# EAGLE schematic WiFi_Board (EAGLE 6.6.0)
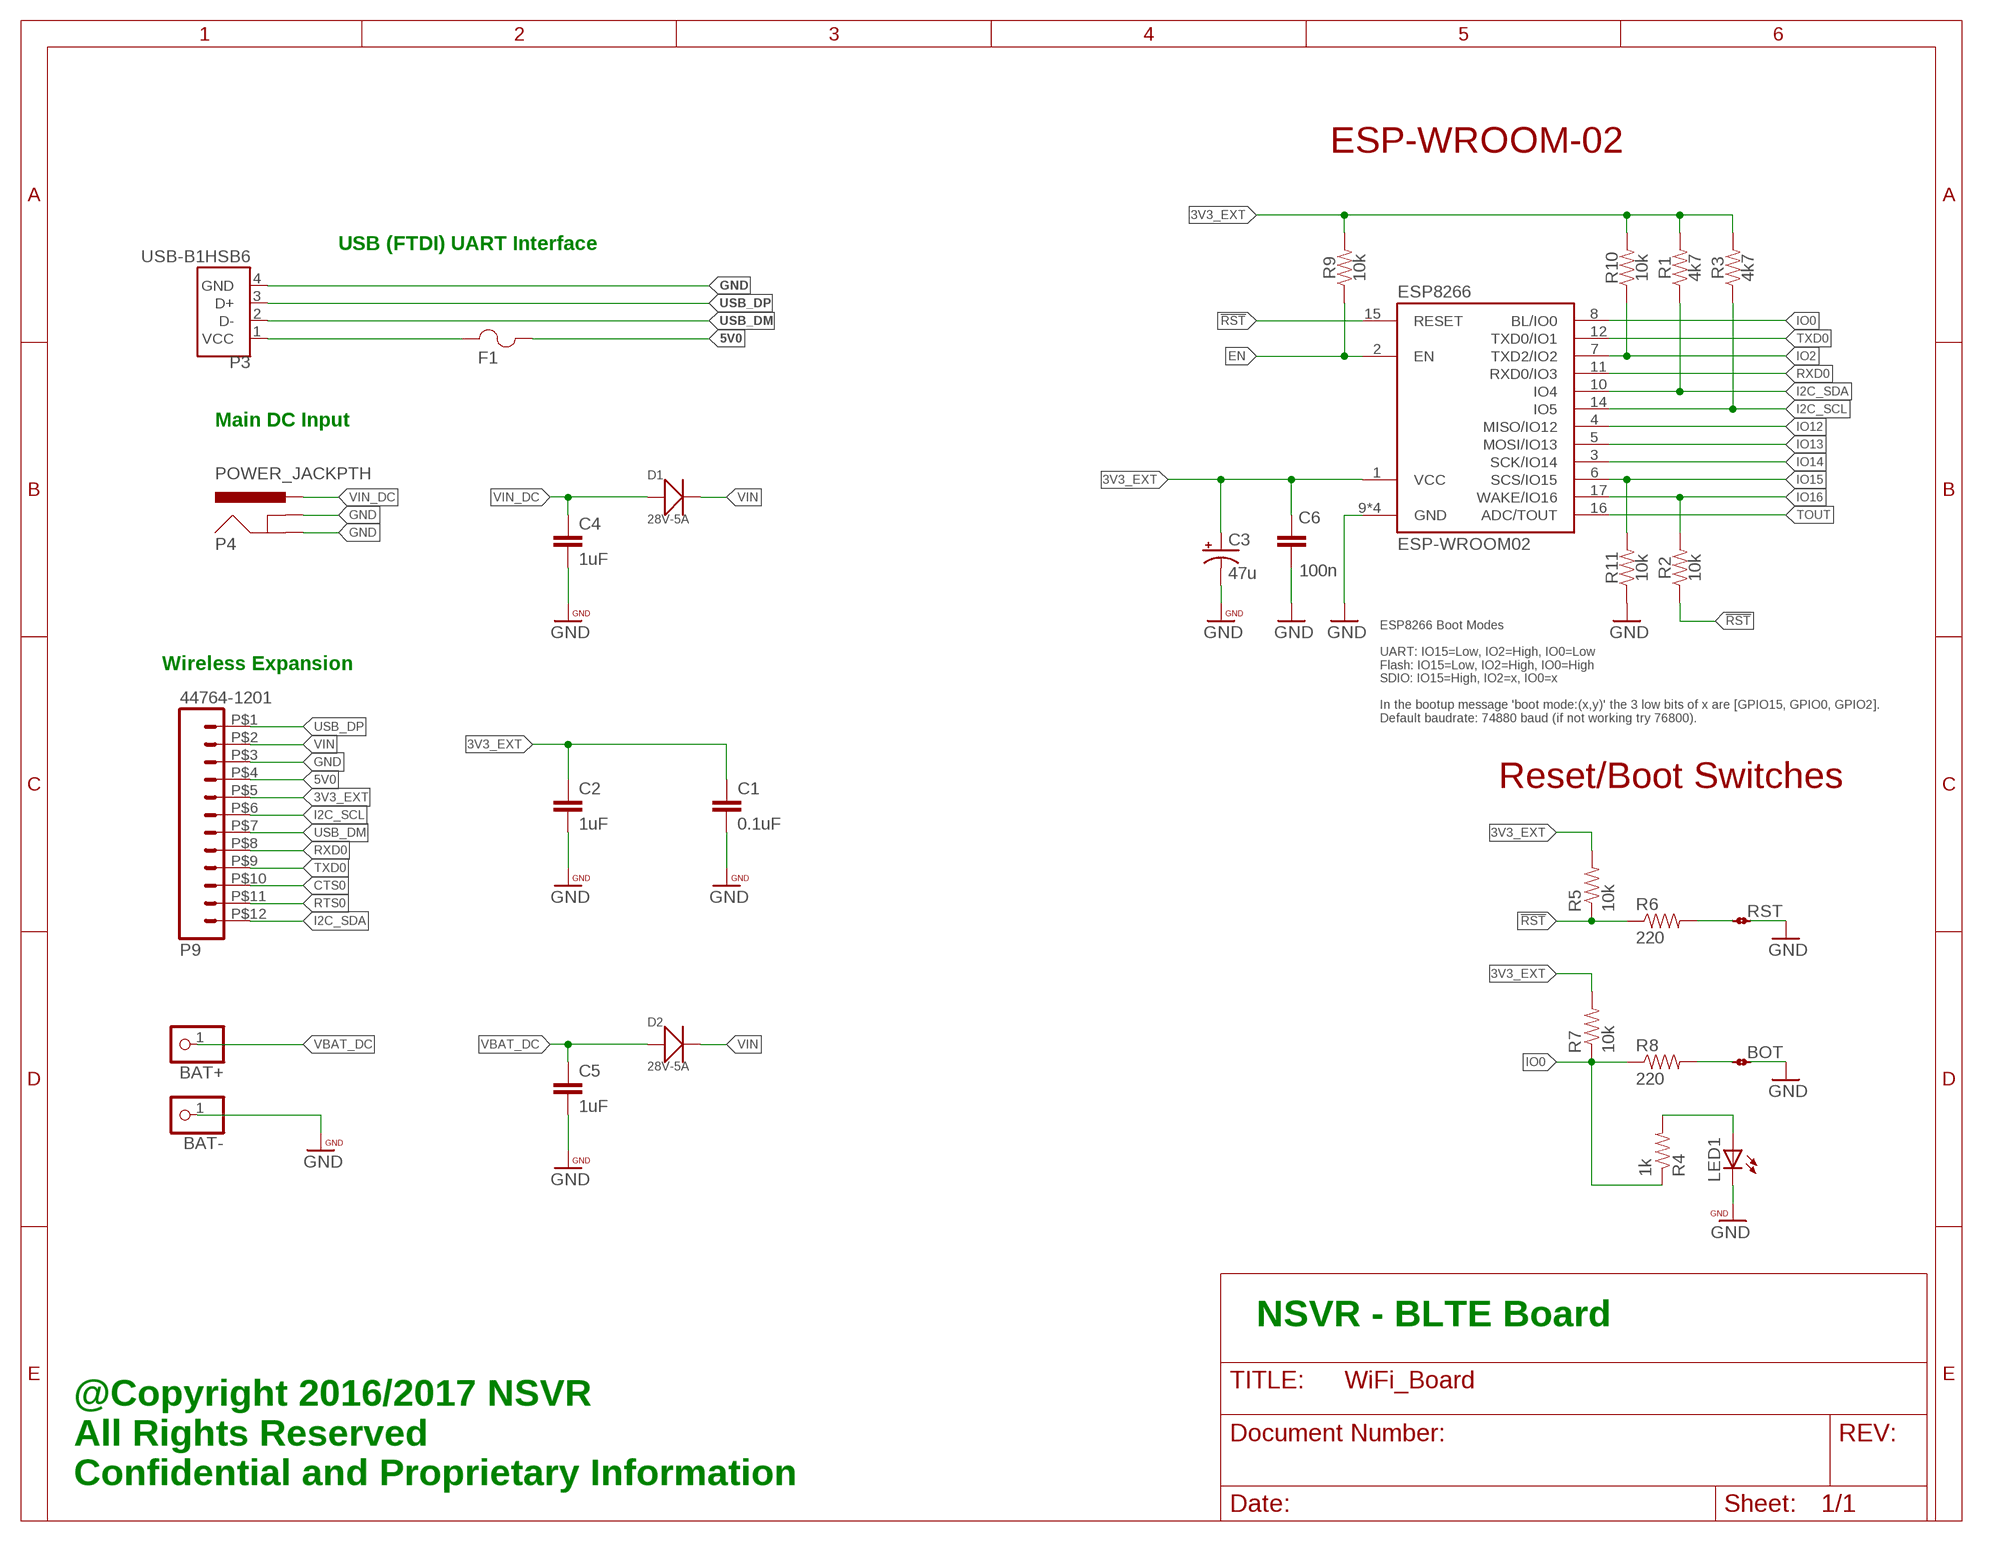
[diagram p0: schematic, sheet 1]

## Parts
BAT+  WPAD-1-PTH  [WPAD-1-PTH-2.54]
BAT-  WPAD-1-PTH  [WPAD-1-PTH-2.54]
BOT  JMP-2-NO-PTH  [JMP-2-NO-PTH-2.54]
C1  0.1uF  CAP0402-CAP  [0402-CAP]
C2  1uF  CAP0402-CAP  [0402-CAP]
C3  47u  CAP_POLD  [PANASONIC_D]
C4  1uF  CAP0402-CAP  [0402-CAP]
C5  1uF  CAP0402-CAP  [0402-CAP]
C6  100n  CAP0402-CAP  [0402-CAP]
D1  28V-5A  SMD-DIODE-SCHOTTKY-28V-5A(DO-214AA)  [DO-214AA]
D2  28V-5A  SMD-DIODE-SCHOTTKY-28V-5A(DO-214AA)  [DO-214AA]
ESP8266  ESP-WROOM02  [ESP-WROOM02]
F1  1206L050YR  [1206LSERIES]
LED1  LEDCHIP-LED0603  [CHIP-LED0603]
P3  USB-B1HSB6  [OST_USB-B1HSB6]
P4  POWER_JACKPTH  [POWER_JACK_PTH]
P9  44764-1201  [44764-1201]
R1  4k7  RESISTOR0402-TYP  [EIA-0402]
R2  10k  RESISTOR0402-TYP  [EIA-0402]
R3  4k7  RESISTOR0402-TYP  [EIA-0402]
R4  1k  RESISTOR0402-TYP  [EIA-0402]
R5  10k  RESISTOR0402-TYP  [EIA-0402]
R6  220  RESISTOR0402-TYP  [EIA-0402]
R7  10k  RESISTOR0402-TYP  [EIA-0402]
R8  220  RESISTOR0402-TYP  [EIA-0402]
R9  10k  RESISTOR0402-TYP  [EIA-0402]
R10  10k  RESISTOR0402-TYP  [EIA-0402]
R11  10k  RESISTOR0402-TYP  [EIA-0402]
RST  JMP-2-NO-PTH  [JMP-2-NO-PTH-2.54]

## Nets
3V3_EXT: C1.1 C2.1 C3.+ C6.2 ESP8266.1(VCC) P9.P$5 R1.2 R3.2 R5.2 R7.2 R9.2 R10.2
5V0: F1.2 P9.P$4
!RST: ESP8266.15(RESET) R2.1 R5.1 R6.1
CTS0: P9.P$10
EN: ESP8266.2(EN) R9.1
GND: BAT-.1 BOT.2 C1.2 C2.2 C3.- C4.2 C5.2 C6.1 ESP8266.9(GND) ESP8266.13(GND) ESP8266.18(GND) ESP8266.TP(GND) LED1.C P3.4(GND) P4.GND P4.GNDBREAK P9.P$3 R11.1 RST.2
I2C_SCL: ESP8266.14(IO5) P9.P$6 R3.1
I2C_SDA: ESP8266.10(IO4) P9.P$12 R1.1
IO0: ESP8266.8(BL/IO0) R4.1 R7.1 R8.1
IO2: ESP8266.7(TXD2/IO2) R10.1
IO12: ESP8266.4(MISO/IO12)
IO13: ESP8266.5(MOSI/IO13)
IO14: ESP8266.3(SCK/IO14)
IO15: ESP8266.6(SCS/IO15) R11.2
IO16: ESP8266.17(WAKE/IO16) R2.2
LED1: LED1.A R4.2
N$1: R6.2 RST.1
N$2: BOT.1 R8.2
RTS0: P9.P$11
RXD0: ESP8266.11(RXD0/IO3) P9.P$8
TOUT: ESP8266.16(ADC/TOUT)
TXD0: ESP8266.12(TXD0/IO1) P9.P$9
USB_DM: P3.2(D-) P9.P$7
USB_DP: P3.3(D+) P9.P$1
VBAT_DC: BAT+.1 C5.1 D2.+
VBUS_IN: F1.1 P3.1(VCC)
VIN: D1.- D2.- P9.P$2
VIN_DC: C4.1 D1.+ P4.PWR

## Notes on the sheet
- ESP-WROOM-02
- USB (FTDI) UART Interface
- Main DC Input
- ESP8266 Boot Modes
  
  UART: IO15=Low, IO2=High, IO0=Low
  Flash: IO15=Low, IO2=High, IO0=High
  SDIO: IO15=High, IO2=x, IO0=x
  
  In the bootup message 'boot mode:(x,y)' the 3 low bits of x are [GPIO15, GPIO0, GPIO2].
  Default baudrate: 74880 baud (if not working try 76800).
- Wireless Expansion
- Reset/Boot Switches
- NSVR - BLTE Board
- @Copyright 2016/2017 NSVR
  All Rights Reserved
  Confidential and Proprietary Information

## Library data of the parts
BAT+ BAT- = PatternAgents-ProtoPads:WPAD-1: Wire Pad - Single Good for scope lead clips, test jumpers, probe points, etc. PatternAgents ProtoPads Library Schematic and PCB layout libraries for design patterns by PatternAgents. For the CADSoft Eagle CAD program : http://www.cadsoftusa.com/download-eagle/ Source LBR : http://www.patternagents.com Github : https://github.com/PatternAgents License : http://creativecommons.org/licenses/by-sa/4.0/ (Creative Commons 4.0) THIS SOFTWARE IS PROVIDED BY THE CONTRIBUTORS "AS IS" AND WITHOUT ANY EXPRESS OR IMPLIED WARRANTIES, INCLUDING, BUT NOT LIMITED TO, THE IMPLIED WARRANTIES OF MERCHANTABILITY AND FITNESS FOR A PARTICULAR PURPOSE ARE DISCLAIMED. IN NO EVENT SHALL THE COPYRIGHT OWNER OR CONTRIBUTORS BE LIABLE FOR ANY DIRECT, INDIRECT, INCIDENTAL, SPECIAL, EXEMPLARY, OR CONSEQUENTIAL DAMAGES (INCLUDING, BUT NOT LIMITED TO, PROCUREMENT OF SUBSTITUTE GOODS OR SERVICES; LOSS OF USE, DATA, OR PROFITS; OR BUSINESS INTERRUPTION) HOWEVER CAUSED AND ON ANY THEORY OF LIABILITY, WHETHER IN CONTRACT, STRICT LIABILITY, OR TORT (INCLUDING NEGLIGENCE OR OTHERWISE) ARISING IN ANY WAY OUT OF THE USE OF THIS SOFTWARE, EVEN IF ADVISED OF THE POSSIBILITY OF SUCH DAMAGE.; BOM: EXCLUDE
BOT RST = PatternAgents-ProtoPads:JMP-2-NO: Two Terminal Jumper - Normally Open Positions 1 and 2 are normally NOT connected. PatternAgents ProtoPads Library Schematic and PCB layout libraries for design patterns by PatternAgents. For the CADSoft Eagle CAD program : http://www.cadsoftusa.com/download-eagle/ Source LBR : http://www.patternagents.com Github : https://github.com/PatternAgents License : http://creativecommons.org/licenses/by-sa/4.0/ (Creative Commons 4.0) THIS SOFTWARE IS PROVIDED BY THE CONTRIBUTORS "AS IS" AND WITHOUT ANY EXPRESS OR IMPLIED WARRANTIES, INCLUDING, BUT NOT LIMITED TO, THE IMPLIED WARRANTIES OF MERCHANTABILITY AND FITNESS FOR A PARTICULAR PURPOSE ARE DISCLAIMED. IN NO EVENT SHALL THE COPYRIGHT OWNER OR CONTRIBUTORS BE LIABLE FOR ANY DIRECT, INDIRECT, INCIDENTAL, SPECIAL, EXEMPLARY, OR CONSEQUENTIAL DAMAGES (INCLUDING, BUT NOT LIMITED TO, PROCUREMENT OF SUBSTITUTE GOODS OR SERVICES; LOSS OF USE, DATA, OR PROFITS; OR BUSINESS INTERRUPTION) HOWEVER CAUSED AND ON ANY THEORY OF LIABILITY, WHETHER IN CONTRACT, STRICT LIABILITY, OR TORT (INCLUDING NEGLIGENCE OR OTHERWISE) ARISING IN ANY WAY OUT OF THE USE OF THIS SOFTWARE, EVEN IF ADVISED OF THE POSSIBILITY OF SUCH DAMAGE.; BOM: EXCLUDE
C1 C2 C4-C6 = PatternAgents-ProtoPads:CAP: Capacitor Standard 0603 ceramic capacitor, and 0.1" leaded capacitor.
C3 = SparkFun-Capacitors:CAP_POL: Capacitor Polarized These are standard SMD and PTH capacitors. Normally 10uF, 47uF, and 100uF in electrolytic and tantalum varieties. Always verify the external diameter of the through hole cap, it varies with capacity, voltage, and manufacturer. The EIA devices should be standard.
D1 D2 = Seeed-Diode-2016:SMD-DIODE-SCHOTTKY-28V-5A(DO-214AA): 304020021; MPN: SS54B
ESP8266 = we-chip:ESP-WROOM02: Espressif ESP-WROOM-02 and AI-Thinker ESP-12 ESP8266 WiFi/WLAN Module
F1 = 1206L050:1206L050YR; COPYRIGHT: Copyright C 2015 Accelerated Designs. All rights reserved; MANUFACTURER_PART_NUMBER: 1206L050YR; VENDOR: Littelfuse Inc
LED1 = led:LED: LED OSRAM: - CHIPLED LG R971, LG N971, LY N971, LG Q971, LY Q971, LO R971, LY R971 LH N974, LH R974 LS Q976, LO Q976, LY Q976 LO Q996 - Hyper CHIPLED LW Q18S LB Q993, LB Q99A, LB R99A - SideLED LS A670, LO A670, LY A670, LG A670, LP A670 LB A673, LV A673, LT A673, LW A673 LH A674 LY A675 LS A676, LA A676, LO A676, LY A676, LW A676 LS A679, LY A679, LG A679 - Hyper Micro SIDELED® LS Y876, LA Y876, LO Y876, LY Y876 LT Y87S - SmartLED LW L88C, LW L88S LB L89C, LB L89S, LG L890 LS L89K, LO L89K, LY L89K LS L896, LA L896, LO L896, LY L896 - TOPLED LS T670, LO T670, LY T670, LG T670, LP T670 LSG T670, LSP T670, LSY T670, LOP T670, LYG T670 LG T671, LOG T671, LSG T671 LB T673, LV T673, LT T673, LW T673 LH T674 LS T676, LA T676, LO T676, LY T676, LB T676, LH T676, LSB T676, LW T676 LB T67C, LV T67C, LT T67C, LS T67K, LO T67K, LY T67K, LW E67C LS E67B, LA E67B, LO E67B, LY E67B, LB E67C, LV E67C, LT E67C LW T67C LS T679, LY T679, LG T679 LS T770, LO T770, LY T770, LG T770, LP T770 LB T773, LV T773, LT T773, LW T773 LH T774 LS E675, LA E675, LY E675, LS T675 LS T776, LA T776, LO T776, LY T776, LB T776 LHGB T686 LT T68C, LB T68C - Hyper Mini TOPLED® LB M676 - Mini TOPLED Santana® LG M470 LS M47K, LO M47K, LY M47K Source: http://www.osram.convergy.de LUXEON: - LUMILED® LXK2-PW12-R00, LXK2-PW12-S00, LXK2-PW14-U00, LXK2-PW14-V00 LXK2-PM12-R00, LXK2-PM12-S00, LXK2-PM14-U00 LXK2-PE12-Q00, LXK2-PE12-R00, LXK2-PE12-S00, LXK2-PE14-T00, LXK2-PE14-U00 LXK2-PB12-K00, LXK2-PB12-L00, LXK2-PB12-M00, LXK2-PB14-N00, LXK2-PB14-P00, LXK2-PB14-Q00 LXK2-PR12-L00, LXK2-PR12-M00, LXK2-PR14-Q00, LXK2-PR14-R00 LXK2-PD12-Q00, LXK2-PD12-R00, LXK2-PD12-S00 LXK2-PH12-R00, LXK2-PH12-S00 LXK2-PL12-P00, LXK2-PL12-Q00, LXK2-PL12-R00 Source: www.luxeon.com KINGBRIGHT: KA-3528ASYC Source: www.kingbright.com
P3 = USB-B1HSB6:USB-B1HSB6: Conn Usb Type b r/a Black; AVAILABILITY: Warning; DESCRIPTION: Conn Usb Type b r/a Black; MF: On Shore Technology; MP: USB-B1HSB6; PACKAGE: None; PRICE: 0.42 USD
P4 = SparkFun-Connectors:POWER_JACK: Power Jack This is the standard 5.5mm barrel jack for power. The PTH is the most common, proven, reliable, footprint. The Slot footprint only works if the mill layer is transmitted to the PCB fab house so be warned. Mating wall wart : TOL-00298 (and others); PROD_ID: CONN-08197
P9 = nsvr:44764-1201
R1-R11 = PatternAgents-ProtoPads:RESISTOR: Resistor Basic schematic elements and footprints for 0603, 1206, and PTH resistors.